# Altium schematic sheet RemoteControl.SchDoc
size A3; SheetNumber: 2; SheetTotal: 2
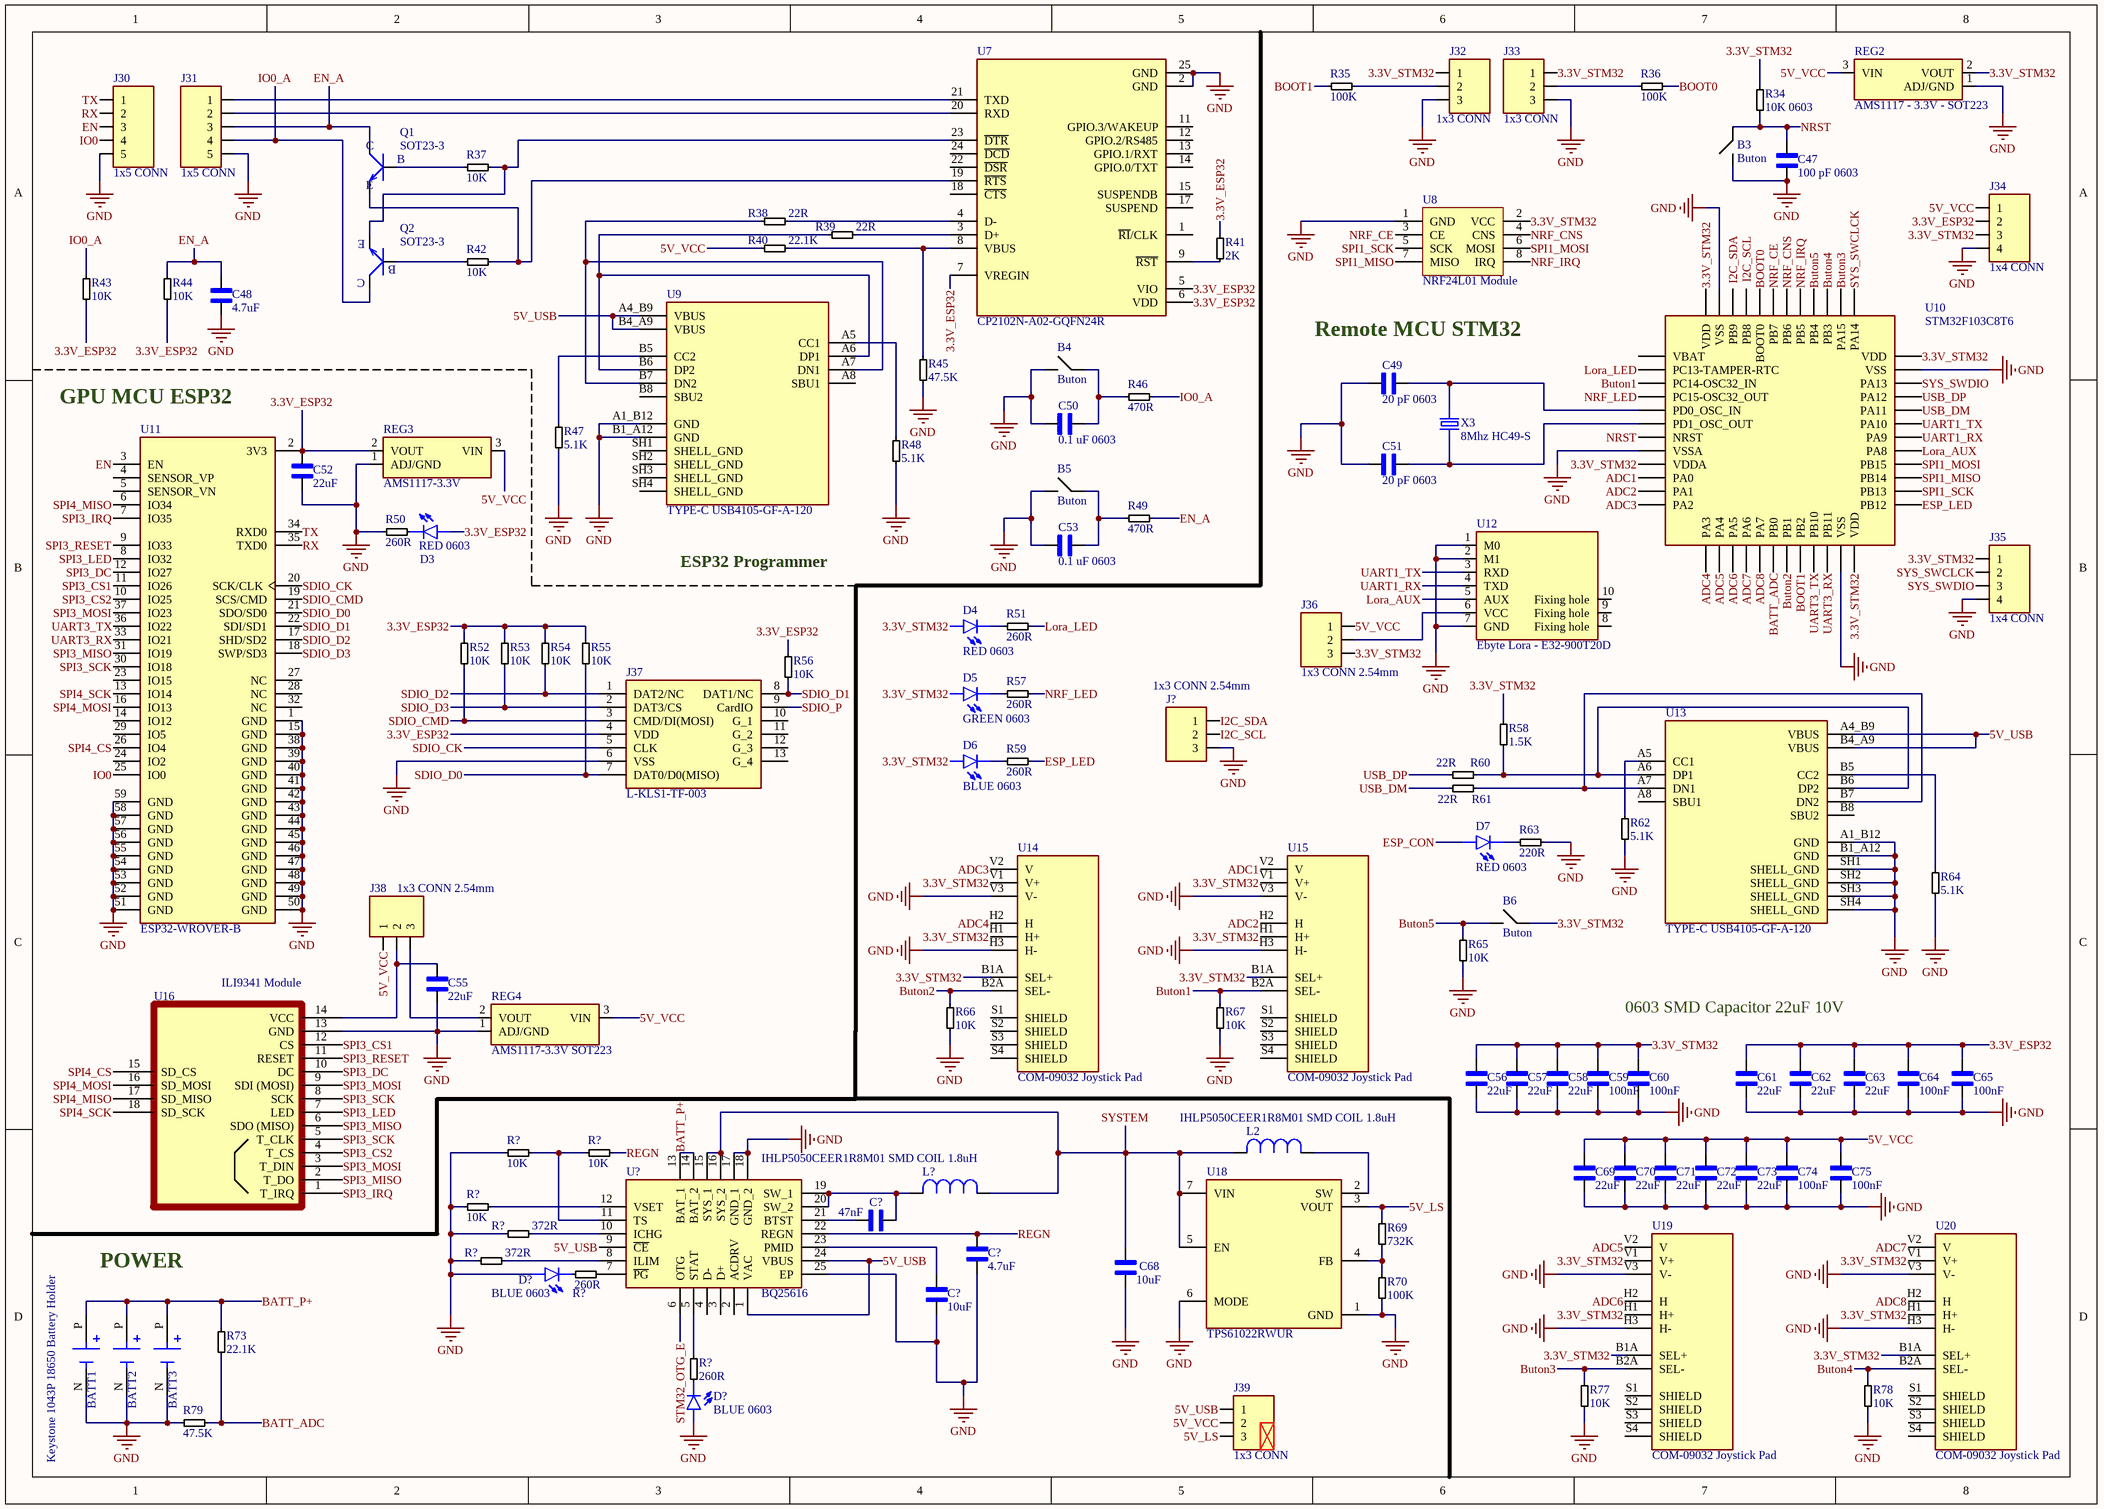
[diagram p0: RemoteControl.SchDoc]

## Parts
(Parts that share a designator on the sheet are numbered #1, #2 ... from top to bottom, then left to right.)
B3  Buton  [SMD TACT SWITCH BUTTON]
B4  Buton  [SMD TACT SWITCH BUTTON]
B5  Buton  [SMD TACT SWITCH BUTTON]
B6  Buton  [SMD TACT SWITCH BUTTON]
BATT1  Keystone 1043P 18650 Battery Holder  [1043P]
BATT2  Keystone 1043P 18650 Battery Holder  [1043P]  (value not drawn)
BATT3  Keystone 1043P 18650 Battery Holder  [1043P]  (value not drawn)
C47  100 pF 0603  [0603 SMD CAP]
C48  4.7uF  [0603 SMD CAP]
C49  20 pF 0603  [0603 SMD CAP]
C50  0.1 uF 0603  [0603 SMD CAP]
C51  20 pF 0603  [0603 SMD CAP]
C52  22uF  [0603 SMD CAP]
C53  0.1 uF 0603  [0603 SMD CAP]
C55  22uF  [0603 SMD CAP]
C56  22uF  [0603 SMD CAP]
C57  22uF  [0603 SMD CAP]
C58  22uF  [0603 SMD CAP]
C59  100nF  [0603 SMD CAP]
C60  100nF  [0603 SMD CAP]
C61  22uF  [0603 SMD CAP]
C62  22uF  [0603 SMD CAP]
C63  22uF  [0603 SMD CAP]
C64  100nF  [0603 SMD CAP]
C65  100nF  [0603 SMD CAP]
C68  10uF  [0603 SMD CAP]
C69  22uF  [0603 SMD CAP]
C70  22uF  [0603 SMD CAP]
C71  22uF  [0603 SMD CAP]
C72  22uF  [0603 SMD CAP]
C73  22uF  [0603 SMD CAP]
C74  100nF  [0603 SMD CAP]
C75  100nF  [0603 SMD CAP]
C?#1  47nF  [0603 SMD CAP]
C?#2  4.7uF  [0603 SMD CAP]
C?#3  10uF  [0603 SMD CAP]
D3  RED 0603  [0603 SMD LED]
D4  RED 0603  [0603 SMD LED]
D5  GREEN 0603  [0603 SMD LED]
D6  BLUE 0603  [0603 SMD LED]
D7  RED 0603  [0603 SMD LED]
D?#1  BLUE 0603  [0603 SMD LED]
D?#2  BLUE 0603  [0603 SMD LED]
J30  1x5 CONN  [CON1x5_2.54MM]
J31  1x5 CONN  [CON1x5_2.54MM]
J32  1x3 CONN  [CON1x3_2.54MM]
J33  1x3 CONN  [CON1x3_2.54MM]
J34  1x4 CONN  [CON1x4_2.54MM]
J35  1x4 CONN  [CON1x4_2.54MM]
J36  1x3 CONN 2.54mm  [CON1x3_2.54MM]
J37  L-KLS1-TF-003  [L-KLS1-TF-003-H1.85-R]
J38  1x3 CONN 2.54mm  [CON1x3_2.54MM]
J39  1x3 CONN  [CON1x3_2.54MM]
J?  1x3 CONN 2.54mm  [CON1x3_2.54MM]
L2  IHLP5050CEER1R8M01 SMD COIL 1.8uH  [IHLP5050CEER6R8M01 SMD COIL 6.8uH]
L?  IHLP5050CEER1R8M01 SMD COIL 1.8uH  [IHLP5050CEER6R8M01 SMD COIL 6.8uH]
Q1  SOT23-3  [SOT23]
Q2  SOT23-3  [SOT23]
R34  10K 0603  [0603 SMD RES]
R35  100K  [0603 SMD RES]
R36  100K  [0603 SMD RES]
R37  10K  [0603 SMD RES]
R38  22R  [0603 SMD RES]
R39  22R  [0603 SMD RES]
R40  22.1K  [0603 SMD RES]
R41  2K  [0603 SMD RES]
R42  10K  [0603 SMD RES]
R43  10K  [0603 SMD RES]
R44  10K  [0603 SMD RES]
R45  47.5K  [0603 SMD RES]
R46  470R  [0603 SMD RES]
R47  5.1K  [0603 SMD RES]
R48  5.1K  [0603 SMD RES]
R49  470R  [0603 SMD RES]
R50  260R  [0603 SMD RES]
R51  260R  [0603 SMD RES]
R52  10K  [0603 SMD RES]
R53  10K  [0603 SMD RES]
R54  10K  [0603 SMD RES]
R55  10K  [0603 SMD RES]
R56  10K  [0603 SMD RES]
R57  260R  [0603 SMD RES]
R58  1.5K  [0603 SMD RES]
R59  260R  [0603 SMD RES]
R60  22R  [0603 SMD RES]
R61  22R  [0603 SMD RES]
R62  5.1K  [0603 SMD RES]
R63  220R  [0603 SMD RES]
R64  5.1K  [0603 SMD RES]
R65  10K  [0603 SMD RES]
R66  10K  [0603 SMD RES]
R67  10K  [0603 SMD RES]
R69  732K  [0603 SMD RES]
R70  100K  [0603 SMD RES]
R73  22.1K  [0603 SMD RES]
R77  10K  [0603 SMD RES]
R78  10K  [0603 SMD RES]
R79  47.5K  [0603 SMD RES]
R?#1  10K  [0603 SMD RES]
R?#2  10K  [0603 SMD RES]
R?#3  10K  [0603 SMD RES]
R?#4  372R  [0603 SMD RES]
R?#5  372R  [0603 SMD RES]
R?#6  260R  [0603 SMD RES]
R?#7  260R  [0603 SMD RES]
REG2  AMS1117 - 3.3V - SOT223  [SOT-223]
REG3  AMS1117-3.3V  [SOT-223]
REG4  AMS1117-3.3V SOT223  [SOT-223]
U7  CP2102N-A02-GQFN24R  [CP2102N-A02-GQFN24R]
U8  NRF24L01 Module  [NRF24L01 MODULE]
U9  TYPE-C USB4105-GF-A-120  [TYPE-C USB4105-GF-A-120]
U10  STM32F103C8T6  [LQFP-48]
U11  ESP32-WROVER-B  [ESP32-WROVER-B]
U12  Ebyte Lora - E32-900T20D  [Ebyte LoRa Modul]
U13  TYPE-C USB4105-GF-A-120  [TYPE-C USB4105-GF-A-120]
U14  COM-09032 Joystick Pad  [XDCR_COM-09032]
U15  COM-09032 Joystick Pad  [XDCR_COM-09032]
U16  ILI9341 Module  [ILI9341 2.8"]
U18  TPS61022RWUR  [TPS61022RWUR]
U19  COM-09032 Joystick Pad  [XDCR_COM-09032]
U20  COM-09032 Joystick Pad  [XDCR_COM-09032]
U?  BQ25616  [WQFN-24]
X3  8Mhz HC49-S  [HC49-S Crystal Oscillator]

## Nets
GND: B3.0 B4.0 B5.0 BATT1.N(NEG) BATT2.N(NEG) BATT3.N(NEG) C47.2 C48.2 C49.2 C50.2 C51.2 C52.2 C53.2 C55.2 C56.2 C57.2 C58.2 C59.2 C60.2 C61.2 C62.2 C63.2 C64.2 C65.2 C68.2 C69.2 C70.2 C71.2 C72.2 C73.2 C74.2 C75.2 C?#2.2 C?#3.1 D?#1.A D?#2.A J30.5 J31.5 J32.3 J33.3 J34.4 J35.4 J37.6(VSS) J?.3 R45.1 R47.1 R48.1 R50.2 R62.1 R63.2 R64.1 R65.1 R66.2 R67.2 R70.2 R77.2 R78.2 R79.2 R?#1.2 R?#3.2 R?#4.1 R?#5.1 REG2.1(ADJ/GND) REG3.1(ADJ/GND) REG4.1(ADJ/GND) U7.2(GND) U7.25(GND) U8.1(GND) U9.A1_B12(GND) U9.B1_A12(GND) U10.8(VSSA) U10.23(VSS) U10.35(VSS) U10.47(VSS) U11.1(GND) U11.15(GND) U11.38(GND) U11.39(GND) U11.40(GND) U11.41(GND) U11.42(GND) U11.43(GND) U11.44(GND) U11.45(GND) U11.46(GND) U11.47(GND) U11.48(GND) U11.49(GND) U11.50(GND) U11.51(GND) U11.52(GND) U11.53(GND) U11.54(GND) U11.55(GND) U11.56(GND) U11.57(GND) U11.58(GND) U11.59(GND) U12.1(M0) U12.2(M1) U12.7(GND) U13.A1_B12(GND) U13.B1_A12(GND) U13.SH1(SHELL_GND) U13.SH2(SHELL_GND) U13.SH3(SHELL_GND) U13.SH4(SHELL_GND) U14.H3(H-) U14.V3(V-) U15.H3(H-) U15.V3(V-) U16.13(GND) U18.1(GND) U18.6(MODE) U19.H3(H-) U19.V3(V-) U20.H3(H-) U20.V3(V-) U?.17(GND_1) U?.18(GND_2) U?.25(EP)
3.3V_ESP32: C52.1 C61.1 C62.1 C63.1 C64.1 C65.1 D3.A J34.2 J37.4(VDD) R41.2 R43.1 R44.1 R52.2 R53.2 R54.2 R55.2 R56.1 REG3.2(VOUT) U7.5(VIO) U7.6(VDD) U7.7(VREGIN) U11.2(3V3)
3.3V_STM32: B6.1 C56.1 C57.1 C58.1 C59.1 C60.1 D4.A D5.A D6.A J32.1 J33.1 J34.3 J35.1 J36.3 R34.1 R58.2 REG2.2(VOUT) U8.2(VCC) U10.9(VDDA) U10.24(VDD) U10.36(VDD) U10.48(VDD) U14.B1A(SEL+) U14.H1(H+) U14.V1(V+) U15.B1A(SEL+) U15.H1(H+) U15.V1(V+) U19.B1A(SEL+) U19.H1(H+) U19.V1(V+) U20.B1A(SEL+) U20.H1(H+) U20.V1(V+)
5V_LS: J39.3 R69.1 U18.3(VOUT)
5V_USB: J39.1 U9.A4_B9(VBUS) U9.B4_A9(VBUS) U13.A4_B9(VBUS) U13.B4_A9(VBUS) U?.1(VAC) U?.9(~{CE}) U?.24(VBUS)
5V_VCC: C69.1 C70.1 C71.1 C72.1 C73.1 C74.1 C75.1 J34.1 J36.1 J38.1 J39.2 R40.1 REG2.3(VIN) REG3.3(VIN) REG4.3(VIN)
ADC1: U10.10(PA0) U15.V2(V)
ADC2: U10.11(PA1) U15.H2(H)
ADC3: U10.12(PA2) U14.V2(V)
ADC4: U10.13(PA3) U14.H2(H)
ADC5: U10.14(PA4) U19.V2(V)
ADC6: U10.15(PA5) U19.H2(H)
ADC7: U10.16(PA6) U20.V2(V)
ADC8: U10.17(PA7) U20.H2(H)
BATT_ADC: R73.1 R79.1 U10.18(PB0)
BATT_P+: BATT1.P(POS) BATT2.P(POS) BATT3.P(POS) R73.2 U?.13(BAT_1) U?.14(BAT_2)
BOOT0: R36.2 U10.44(BOOT0)
BOOT1: R35.1 U10.20(PB2)
Buton1: R67.1 U10.3(PC14-OSC32_IN) U15.B2A(SEL-)
Buton2: R66.1 U10.19(PB1) U14.B2A(SEL-)
Buton3: R77.1 U10.38(PA15) U19.B2A(SEL-)
Buton4: R78.1 U10.39(PB3) U20.B2A(SEL-)
Buton5: B6.0 R65.2 U10.40(PB4)
EN: J30.3 U11.3(EN)
EN_A: C48.1 J31.3 Q1.3(C) R44.2 R49.2
ESP_CON: D7.A
ESP_LED: R59.2 U10.25(PB12)
I2C_SCL: J?.2
I2C_SDA: J?.1
IO0: J30.4 U11.25(IO0)
IO0_A: J31.4 Q2.3(C) R43.2 R46.2
Lora_AUX: U10.29(PA8) U12.5(AUX)
Lora_LED: R51.2 U10.2(PC13-TAMPER-RTC)
NRF_CE: U8.3(CE) U10.43(PB7)
NRF_CNS: U8.4(CNS) U10.42(PB6)
NRF_IRQ: U8.8(IRQ) U10.41(PB5)
NRF_LED: R57.2 U10.4(PC15-OSC32_OUT)
NRST: B3.1 C47.1 R34.2 U10.7(NRST)
REGN: C?#2.1 R?#2.2 U?.22(REGN)
RX: J30.2 U11.35(TXD0)
SDIO_CK: J37.5(CLK) U11.20(SCK/CLK)
SDIO_CMD: J37.3(CMD/DI(MOSI)) R52.1 U11.19(SCS/CMD)
SDIO_D0: J37.7(DAT0/D0(MISO)) R55.1 U11.21(SDO/SD0)
SDIO_D1: J37.8(DAT1/NC) R56.2 U11.22(SDI/SD1)
SDIO_D2: J37.1(DAT2/NC) R54.1 U11.17(SHD/SD2)
SDIO_D3: J37.2(DAT3/CS) R53.1 U11.18(SWP/SD3)
SDIO_P: J37.9(CardIO)
SPI1_MISO: U8.7(MISO) U10.27(PB14)
SPI1_MOSI: U8.6(MOSI) U10.28(PB15)
SPI1_SCK: U8.5(SCK) U10.26(PB13)
SPI3_CS1: U11.11(IO26) U16.12(CS)
SPI3_CS2: U11.10(IO25) U16.4(T_CS)
SPI3_DC: U11.12(IO27) U16.10(DC)
SPI3_IRQ: U11.7(IO35) U16.1(T_IRQ)
SPI3_LED: U11.8(IO32) U16.7(LED)
SPI3_MISO: U11.31(IO19) U16.2(T_DO) U16.6(SDO_(MISO))
SPI3_MOSI: U11.37(IO23) U16.3(T_DIN) U16.9(SDI_(MOSI))
SPI3_RESET: U11.9(IO33) U16.11(RESET)
SPI3_SCK: U11.30(IO18) U16.5(T_CLK) U16.8(SCK)
SPI4_CS: U11.26(IO4) U16.15(SD_CS)
SPI4_MISO: U11.6(IO34) U16.17(SD_MISO)
SPI4_MOSI: U11.16(IO13) U16.16(SD_MOSI)
SPI4_SCK: U11.13(IO14) U16.18(SD_SCK)
STM32_OTG_E: U?.6(OTG)
SYS_SWCLCK: J35.2 U10.37(PA14)
SYS_SWDIO: J35.3 U10.34(PA13)
SYSTEM: C68.1 L2.V_1 L?.V_2 U18.5(EN) U18.7(VIN) U?.15(SYS_1) U?.16(SYS_2)
TX: J30.1 U11.34(RXD0)
UART1_RX: U10.30(PA9) U12.4(TXD)
UART1_TX: U10.31(PA10) U12.3(RXD)
UART3_RX: U10.22(PB11) U11.33(IO21)
UART3_TX: U10.21(PB10) U11.36(IO22)
USB_DM: R61.1 U10.32(PA11)
USB_DP: R60.1 U10.33(PA12)
NetB4_1: B4.1 C50.1 R46.1
NetB5_1: B5.1 C53.1 R49.1
NetC49_1: C49.1 U10.5(PD0_OSC_IN) X3.2
NetC51_1: C51.1 U10.6(PD1_OSC_OUT) X3.1
NetC55_1: C55.1 J38.2 U16.14(VCC)
NetC?#1_1: C?#1.1 U?.21(BTST)
NetC?#1_2: C?#1.2 L?.V_1 U?.19(SW_1) U?.20(SW_2)
NetC?#3_2: C?#3.2 U?.23(PMID)
NetD3_C: D3.C R50.1
NetD4_C: D4.C R51.1
NetD5_C: D5.C R57.1
NetD6_C: D6.C R59.1
NetD7_C: D7.C R63.1
NetD?#1_C: D?#1.C R?#6.1
NetD?#2_C: D?#2.C R?#7.1
NetJ31_1: J31.1 U7.21(TXD)
NetJ31_2: J31.2 U7.20(RXD)
NetJ32_2: J32.2 R35.2
NetJ33_2: J33.2 R36.1
NetJ36_2: J36.2 U12.6(VCC)
NetJ38_3: J38.3 REG4.2(VOUT)
NetL2_V_2: L2.V_2 U18.2(SW)
NetQ1_1: Q1.1(B) R37.1
NetQ1_2: Q1.2(E) R42.2 U7.19(~{RTS})
NetQ2_1: Q2.1(B) R42.1
NetQ2_2: Q2.2(E) R37.2 U7.23(~{DTR})
NetR38_1: R38.1 U9.A7(DN1) U9.B7(DN2)
NetR38_2: R38.2 U7.4(D-)
NetR39_1: R39.1 U9.A6(DP1) U9.B6(DP2)
NetR39_2: R39.2 U7.3(D+)
NetR40_2: R40.2 R45.2 U7.8(VBUS)
NetR41_1: R41.1 U7.9(~{RST})
NetR47_2: R47.2 U9.B5(CC2)
NetR48_2: R48.2 U9.A5(CC1)
NetR58_1: R58.1 R60.2 U13.A6(DP1) U13.B6(DP2)
NetR61_2: R61.2 U13.A7(DN1) U13.B7(DN2)
NetR62_2: R62.2 U13.A5(CC1)
NetR64_2: R64.2 U13.B5(CC2)
NetR69_2: R69.2 R70.1 U18.4(FB)
NetR?#1_1: R?#1.1 R?#2.1 U?.11(TS)
NetR?#3_1: R?#3.1 U?.12(VSET)
NetR?#4_2: R?#4.2 U?.10(ICHG)
NetR?#5_2: R?#5.2 U?.8(ILIM)
NetR?#6_2: R?#6.2 U?.7(~{PG})
NetR?#7_2: R?#7.2 U?.5(STAT)

Not connected (* = marked no-connect by the designer): J37 10(G_1) 11(G_2) 12(G_3) 13(G_4); U7 1(~{RI}/CLK) 11(GPIO.3/WAKEUP) 12(GPIO.2/RS485) 13(GPIO.1/RXT) 14(GPIO.0/TXT) 15(SUSPENDB) 17(SUSPEND) 18(~{CTS}) 22(~{DSR}) 24(~{DCD}); U9 A8(SBU1) B8(SBU2) SH1(SHELL_GND) SH2(SHELL_GND) SH3(SHELL_GND) SH4(SHELL_GND); U10 1(VBAT) 45(PB8) 46(PB9); U11 4(SENSOR_VP) 5(SENSOR_VN) 14(IO12) 23(IO15) 24(IO2) 27(NC) 28(NC) 29(IO5) 32(NC); U12 8(Fixing_hole) 9(Fixing_hole) 10(Fixing_hole); U13 A8(SBU1) B8(SBU2); U14 S1(SHIELD) S2(SHIELD) S3(SHIELD) S4(SHIELD); U15 S1(SHIELD) S2(SHIELD) S3(SHIELD) S4(SHIELD); U19 S1(SHIELD) S2(SHIELD) S3(SHIELD) S4(SHIELD); U20 S1(SHIELD) S2(SHIELD) S3(SHIELD) S4(SHIELD); U? 2(ACDRV) 3(D+) 4(D-)

## Notes on the sheet
- Remote MCU STM32
- (near U11) GPU MCU ESP32
- ESP32 Programmer
- 0603 SMD Capacitor 22uF 10V
- POWER
- Labels drawn without touching a wire or pin: I2C_SCL, I2C_SDA

## Library data of the parts
B3-B6 = SMD TACT SWITCH BUTTON
BATT1-BATT3 = 1043P 18650 Battery Holder
C47-C53 C55-C65 C68-C75 C?#1-C?#3 = CAP SMD 603
D3-D7 D?#1 D?#2 = LED 603 SMD
J30 J31 = CON1x5_2.54mm
J32 J33 J36 J38 J39 J? = CON1x3_2.54mm
J34 J35 = CON1x4_2.54mm
J37 = L-KLS1-TF-003-H1.85-R
L2 L? = IHLP5050CEER6R8M01 SMD COIL 6.8uH
Q1 Q2 = S8050 BJT NPN: Bipolar (BJT) Transistor NPN 25 V 500 mA 150MHz 300 mW Surface Mount SOT-23N
R34-R67 R69 R70 R73 R77-R79 R?#1-R?#7 = RES SMD 0603
REG2-REG4 = AMS1117
U12 = Ebyte Lora
U14 U15 U19 U20 = COM-09032
X3 = HC49-S Crystal Oscillator